# Altium schematic sheet F427&IMU Power Supply.SchDoc
size A4; Organization: Altium Limited; Address1: L3, 12a Rodborough Rd; Address2: Frenchs Forest; Address3: NSW; Address4: Australia 2086
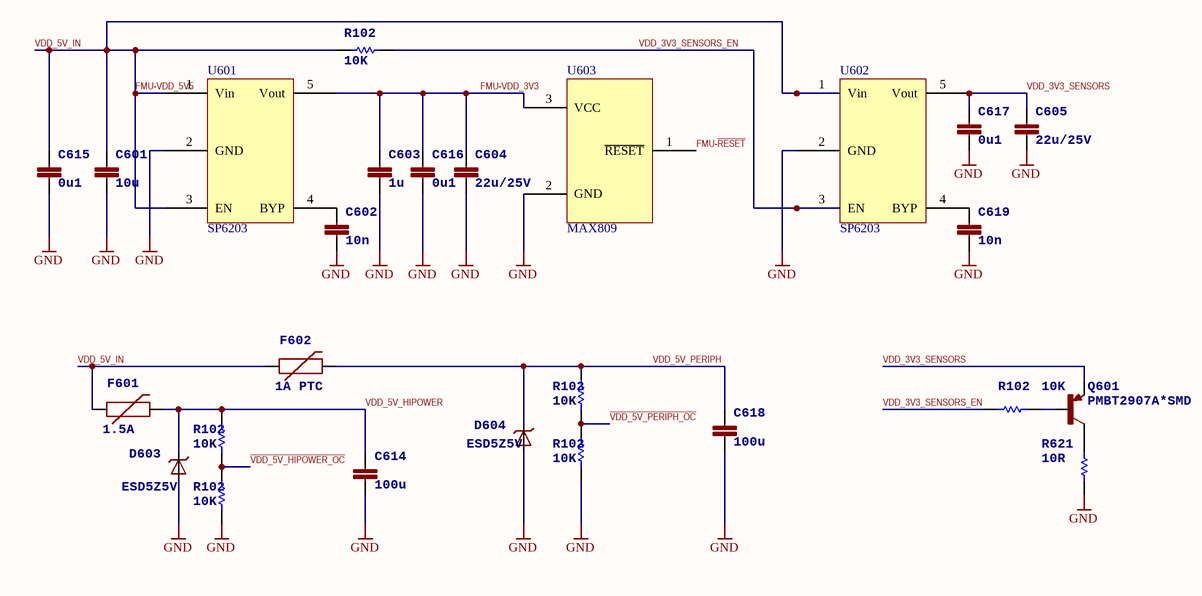
[diagram p0: F427&IMU Power Supply.SchDoc]

## Parts
C601  >NAME: C601  [0805-CAP]  (hidden comment: 10u)
C602  >NAME: C602  [0603-CAP]  (hidden comment: 10n)
C603  >NAME: C603  [0603-CAP]  (hidden comment: 1u)
C604  >NAME: C604  [0805-CAP]  (hidden comment: 22u/25V)
C605  >NAME: C605  [0805-CAP]  (hidden comment: 22u/25V)
C614  >NAME: C614  [1206-CAP]  (hidden comment: 100u)
C615  >NAME: C615  [0603-CAP]  (hidden comment: 0u1)
C616  >NAME: C616  [0603-CAP]  (hidden comment: 0u1)
C617  >NAME: C617  [0603-CAP]  (hidden comment: 0u1)
C618  >NAME: C618  [1206-CAP]  (hidden comment: 100u)
C619  >NAME: C619  [0603-CAP]  (hidden comment: 10n)
D603  ESD5Z5V  [SOD523]
D604  ESD5Z5V  [SOD523]
F601  >NAME: F601  >VALUE: 1.5A  [PTC-1206]  (hidden comment: 2A PTC)
F602  >NAME: F602  [PTC-1206]  (hidden comment: 1A PTC)
Q601  PMBT2907A*SMD  [SOT23-BEC]
R602  >NAME: R102  [0603-RES]  (hidden comment: 10K)
R603  >NAME: R102  [0603-RES]  (hidden comment: 10K)
R604  >NAME: R102  [0603-RES]  (hidden comment: 10K)
R616  >NAME: R102  [0603-RES]  (hidden comment: 10K)
R617  >NAME: R102  [0603-RES]  (hidden comment: 10K)
R620  >NAME: R102  [0603-RES]  (hidden comment: 10K)
R621  >NAME: R621  [0603-RES]  (hidden comment: 10R)
U601  SP6203  [SOT23-5]
U602  SP6203  [SOT23-5]
U603  MAX809  [SOT-23B_N]

## Nets
GND: C601.P$2 C602.P$2 C603.P$2 C604.P$2 C605.P$2 C614.P$2 C615.P$2 C616.P$2 C617.P$2 C618.P$2 C619.P$2 D603.A D604.A R616.P$2 R617.P$2 R621.P$1 U601.2(GND) U602.2(GND) U603.2(GND)
FMU-~{RESET}: U603.1(~{RESET})
FMU-VDD_3V3: C603.P$1 C604.P$1 C616.P$1 U601.5(Vout) U603.3(VCC)
FMU-VDD_5V5: C601.P$1 C615.P$1 F601.1 F602.1 R603.P$1 U601.1(Vin) U601.3(EN) U602.1(Vin)  [also labelled VDD_5V_IN]
~{VDD_5V_HIPOWER_OC}: R602.P$1 R617.P$1
~{VDD_5V_PERIPH_OC}: R604.P$1 R616.P$1
VDD_3V3_SENSORS: C605.P$1 C617.P$1 Q601.E U602.5(Vout)
VDD_3V3_SENSORS_EN: R603.P$2 R620.P$2 U602.3(EN)
VDD_5V_HIPOWER: C614.P$1 D603.C F601.2 R602.P$2
VDD_5V_PERIPH: C618.P$1 D604.C F602.2 R604.P$2
NetC602_P$1: C602.P$1 U601.4(BYP)
NetC619_P$1: C619.P$1 U602.4(BYP)
NetQ601_B: Q601.B R620.P$1
NetQ601_C: Q601.C R621.P$2

## Notes on the sheet
- Title
- Size:
- Date:
- A4
- Number:
- Time:
- Revision:
- Sheet
- of
- File:

## Library data of the parts
C601 C602 C619 = CAP0805: <b>Capacitor</b> / Standard 0603 ceramic capacitor, and 0.1" leaded capacitor.; PARTNO: CL21A106KAYNNNE
  C601: >VALUE: 10u
  C602 C619: >VALUE: 10n
C603 = CAP0603: <b>Capacitor</b> / Standard 0603 ceramic capacitor, and 0.1" leaded capacitor.; PARTNO: CC0603ZRY5V7BB105; >VALUE: 1u
C604 C605 = CAP0805: <b>Capacitor</b> / Standard 0603 ceramic capacitor, and 0.1" leaded capacitor.; PARTNO: CL21A226MAQNNNE; >VALUE: 22u/25V
C614 C618 = CAP1206: <b>Capacitor</b> / Standard 0603 ceramic capacitor, and 0.1" leaded capacitor.; PARTNO: C3216X5R1A107M160AC; >VALUE: 100u
C615-C617 = CAP0402: <b>Capacitor</b> / Standard 0603 ceramic capacitor, and 0.1" leaded capacitor.; PARTNO: CC0402ZRY5V7BB104; >VALUE: 0u1
D603 D604 = DIODE-TVS
F601 F602 = PTCSMD: <b>Resettable Fuse PTC</b> / Resettable Fuse. Spark Fun Electronics SKU : COM-08357
  F601: PARTNO: 2A PTC
  F602: PARTNO: 1A PTC; >VALUE: 1A PTC
Q601 = MMBT3906*SMD: <b>PNP Transistror</b>
R602-R604 R616 R617 R620 = RESISTOR0402-RES: <b>Resistor</b> / Basic schematic elements and footprints for 0603, 1206, and PTH 1/10th watt (small) resistors.; PARTNO: RC0402FR-0710KL; >VALUE: 10K
R621 = RESISTOR0603-RES: <b>Resistor</b> / Basic schematic elements and footprints for 0603, 1206, and PTH 1/10th watt (small) resistors.; PARTNO: RC1608J100CS; >VALUE: 10R
U601 U602 = SP6203: LDO with reset